# Altium project GB2530-K.PrjPcb
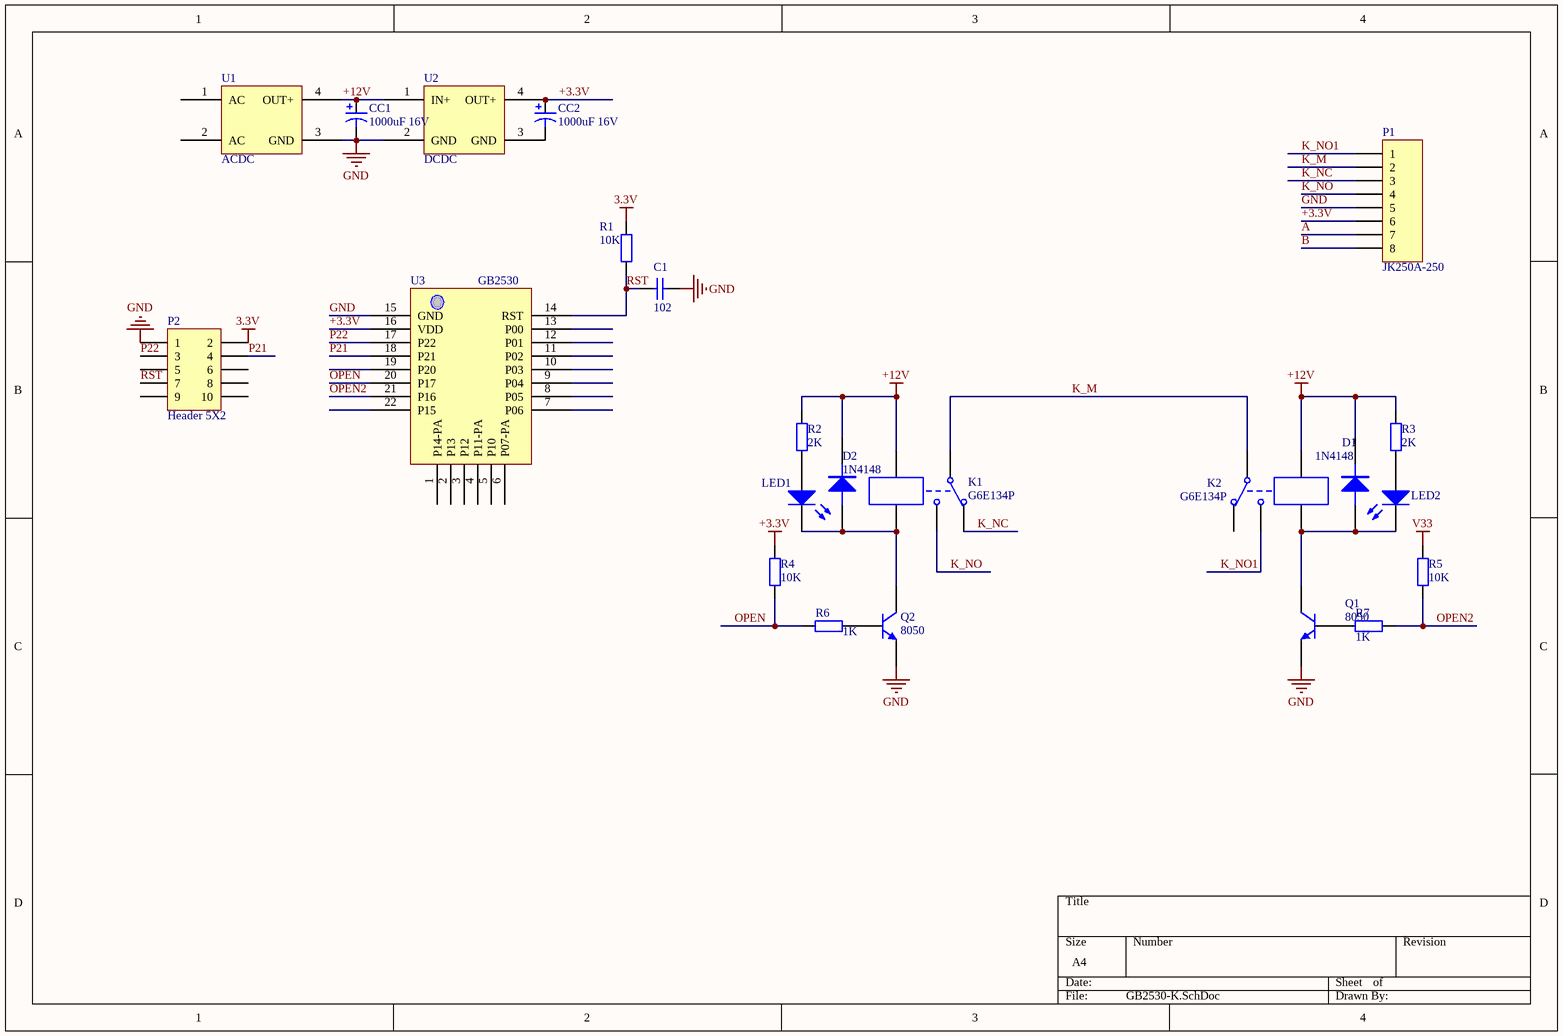
[diagram p0: GB2530-K.SchDoc]
1 sheet, 23 parts. Net scope: global (net labels, ports and power ports of the same name join across sheets).
Board file: GB2530-K.PcbDoc

## Sheet GB2530-K.SchDoc
size A4

### Parts
C1  value 102  [0603]  (hidden comment: Cap)
CC1  value 1000uF 16V  [C1010]  (hidden comment: Cap Pol1)
CC2  value 1000uF 16V  [C1010]  (hidden comment: Cap Pol1)
D1  1N4148  [DO-214AC - Diode]
D2  1N4148  [DO-214AC - Diode]
K1  G6E134P  [G6E134PUS]
K2  G6E134P  [G6E134PUS]
LED1  DS108  [LED0805]  (value not drawn)
LED2  DS108  [LED0805]  (value not drawn)
P1  JK250A-250  [KF250-2.5]
P2  Header 5X2  [HDR2X5]
Q1  8050  [SOT-23]
Q2  8050  [SOT-23]
R1  value 10K  [AXIAL-0.4]  (hidden comment: Res2)
R2  2K  [x0805]
R3  2K  [x0805]
R4  10K  [R0603]
R5  10K  [R0603]
R6  1K  [R0603]
R7  1K  [R0603]
U1  ACDC  [ACDC]
U2  DCDC  [DCDC]
U3  GB2530  [TT-2530]

### Nets
3.3V: P2.2 R1.2
+3.3V: CC2.1 P1.6 R4.1 U2.4(OUT+) U3.16(VDD)
+12V: CC1.1 D1.2(K) D2.2(K) K1.1 K2.1 R2.2 R3.2 U1.4(OUT+) U2.1(IN+)
GND: C1.2 CC1.2 P1.5 P2.1 Q1.2(E) Q2.2(E) U1.3(GND) U2.2(GND) U3.15(GND)
V33: R5.1
A: P1.7
B: P1.8
K_M: K1.7 K2.7 P1.2
K_NC: K1.10 P1.3
K_NO: K1.12 P1.4
K_NO1: K2.12 P1.1
OPEN: R4.2 R6.2 U3.20(P17)
OPEN2: R5.2 R7.2 U3.21(P16)
P21: P2.4 U3.18(P21)
P22: P2.3 U3.17(P22)
RST: C1.1 P2.7 R1.1 U3.14(RST)
NetCC2_2: CC2.2 U2.3(GND)
NetD1_1: D1.1(A) K2.6 LED2.2(K) Q1.3(C)
NetD2_1: D2.1(A) K1.6 LED1.2(K) Q2.3(C)
NetLED1_1: LED1.1(A) R2.1
NetLED2_1: LED2.1(A) R3.1
NetQ1_1: Q1.1(B) R7.1
NetQ2_1: Q2.1(B) R6.1

Not connected (* = marked no-connect by the designer): K2 10; P2 5 6 8 9 10; U1 1(AC) 2(AC); U3 1(P14-PA) 2(P13) 3(P12) 4(P11-PA) 5(P10) 6(P07-PA) 7(P06) 8(P05) 9(P04) 10(P03) 11(P02) 12(P01) 13(P00) 19(P20) 22(P15)

### Library data of the parts
C1 = Cap: Capacitor; Published: 8-Jun-2000; LatestRevisionDate: 17-Jul-2002; LatestRevisionNote: Re-released for DXP Platform.; PackageReference: RAD-0.3; Publisher: Altium Limited; PackageDescription: Radial Cap, Thru-Hole; 2 Leads; 0.3 in Pin Spacing
CC1 CC2 = Cap Pol1: Polarized Capacitor (Radial); Published: 8-Jun-2000; LatestRevisionDate: 17-Jul-2002; LatestRevisionNote: Re-released for DXP Platform.; PackageReference: RB7.6-15; Publisher: Altium Limited; PackageDescription: Polarized Capacitor (Radial); 2 Leads
D1 D2 = DIODE
K1 K2 = Relay-SPDT: Single-Pole Dual-Throw Relay; Published: 24-Mar-1999; LatestRevisionDate: 17-Jul-2002; LatestRevisionNote: Re-released for DXP Platform.; PackageReference: MODULE5B; Publisher: Altium Limited
LED1 LED2 = LED2: Typical RED, GREEN, YELLOW, AMBER GaAs LED; Published: 8-Jun-2000; LatestRevisionDate: 17-Jul-2002; LatestRevisionNote: Re-released for DXP Platform.; Publisher: Altium Limited
P1 = Header 8: LatestRevisionDate: 17-Jul-2002; LatestRevisionNote: Re-released for DXP Platform.; Publisher: Altium Limited
P2 = Header 5X2: Header, 5-Pin, Dual row; LatestRevisionDate: 17-Jul-2002; LatestRevisionNote: Re-released for DXP Platform.; Publisher: Altium Limited
Q1 Q2 = 2N3904: NPN General Purpose Amplifier; Published: 8-Jun-2000; LatestRevisionDate: 15-Jan-2003; LatestRevisionNote: PCB Footprint 'BCY-W3/D4.7' replaced; DatasheetVersion: 1997; PackageVersion: Sep-1998; PackageReference: TO-92A; Publisher: Altium Limited; PackageDescription: TO, Flat Index; 3 In-Line, Axial Leads; Body Dia. 4.5mm; Leads 0.51 x 0.48 mm (max); ComponentLink1Description: Manufacturer Link; ComponentLink1URL: http://www.fairchildsemi.com/; ComponentLink2Description: Datasheet; ComponentLink2URL: http://www.fairchildsemi.com/ds/2N%2F2N3904.pdf
R1 = Res2: Resistor; Published: 8-Jun-2000; LatestRevisionDate: 17-Jul-2002; LatestRevisionNote: Re-released for DXP Platform.; PackageReference: AXIAL-0.4; Publisher: Altium Limited; PackageDescription: Axial Device, Thru-Hole; 2 Leads; 0.4 in Pin Spacing
R2 R3 = Res2: Resistor; Value: 510; Published: 8-Jun-2000; LatestRevisionDate: 17-Jul-2002; LatestRevisionNote: Re-released for DXP Platform.; Publisher: Altium Limited
R4-R7 = Res2: Resistor; Manufacturer: Generic Components; Class: Passive; Value: 10R~100R; Published: 08/06/2000; Publisher: Altium Hobart Technology Centre; SubClass: Resistor